# EAGLE design KeyJam (EAGLE 9.6.2)
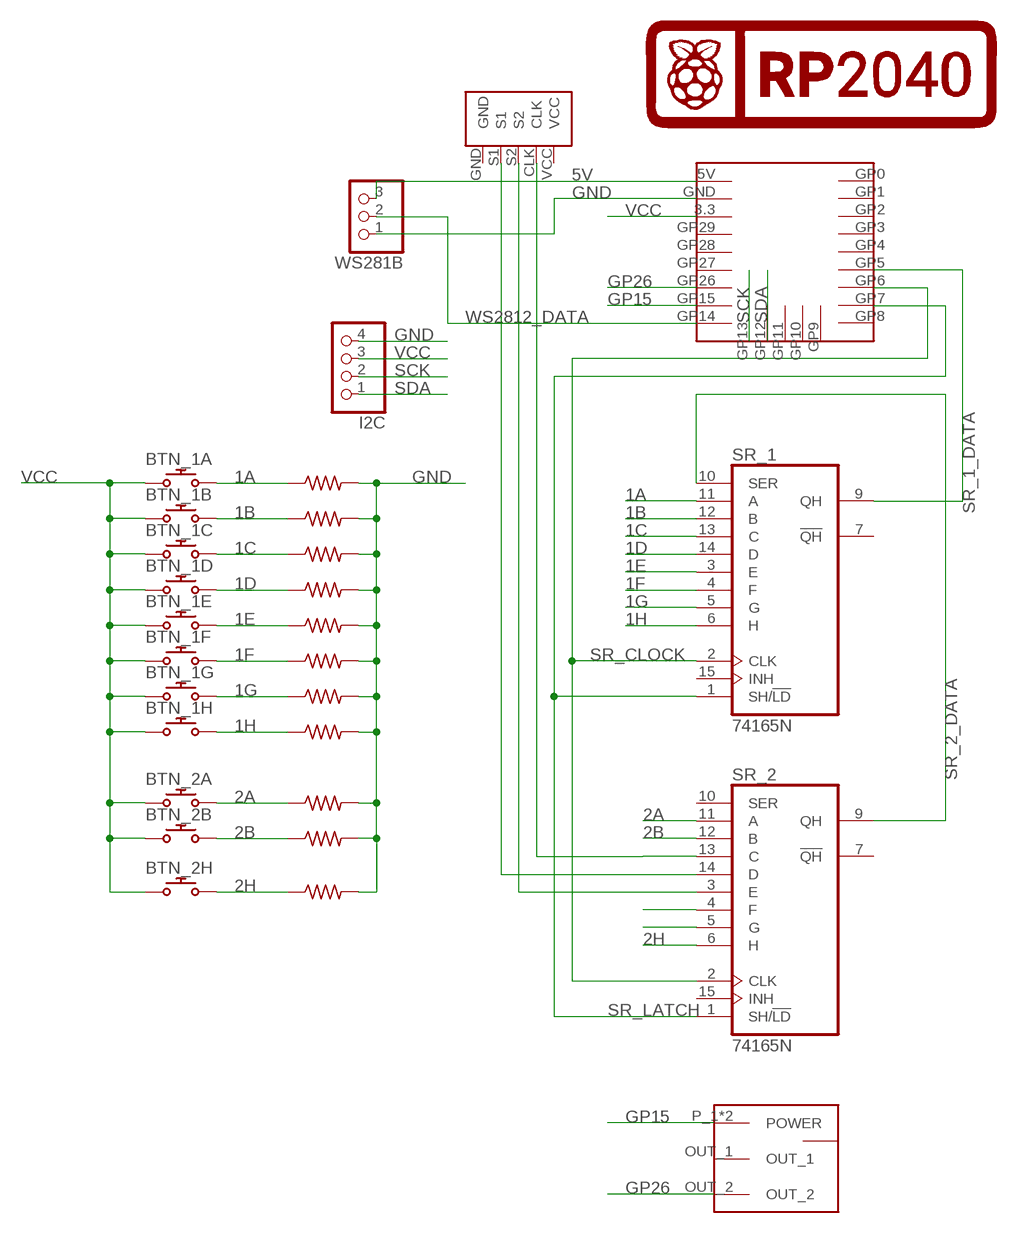
[diagram p0: schematic, sheet 1]

## Parts
BTN_1A  MX_SWITCH  [MX_SWITCH]
BTN_1B  MX_SWITCH  [MX_SWITCH]
BTN_1C  MX_SWITCH  [MX_SWITCH]
BTN_1D  MX_SWITCH  [MX_SWITCH]
BTN_1E  MX_SWITCH  [MX_SWITCH]
BTN_1F  MX_SWITCH  [MX_SWITCH]
BTN_1G  MX_SWITCH  [MX_SWITCH]
BTN_1H  MX_SWITCH  [MX_SWITCH]
BTN_2A  MX_SWITCH  [MX_SWITCH]
BTN_2B  MX_SWITCH  [MX_SWITCH]
BTN_2H  MX_SWITCH  [MX_SWITCH]
I2C  PINHD-1X4  [1X04]
R1  R-US_R1206  [R1206]
R2  R-US_R1206  [R1206]
R3  R-US_R1206  [R1206]
R4  R-US_R1206  [R1206]
R5  R-US_R1206  [R1206]
R6  R-US_R1206  [R1206]
R7  R-US_R1206  [R1206]
R8  R-US_R1206  [R1206]
R9  R-US_R1206  [R1206]
R10  R-US_R1206  [R1206]
R11  R-US_R1206  [R1206]
SLIDER  SLIDER  [SLIDER]
SR_1  74165N  [DIL16]
SR_2  74165N  [DIL16]
U$1  RP2040-ZERO  [RP2040-ZERO]
U$2  ROUND_ROTARY  [ROUND_ROTARY]
U$3  RASPI_RP2040_LOGO_20MM  [RASPI_RP2040_LOGO_20MM]
WS281B  PINHD-1X3  [1X03]

## Nets
1A: BTN_1A.$2 R1.1 SR_1.11(A)
1B: BTN_1B.$2 R2.1 SR_1.12(B)
1C: BTN_1C.$2 R3.1 SR_1.13(C)
1D: BTN_1D.$2 R4.1 SR_1.14(D)
1E: BTN_1E.$2 R5.1 SR_1.3(E)
1F: BTN_1F.$2 R6.1 SR_1.4(F)
1G: BTN_1G.$2 R7.1 SR_1.5(G)
1H: BTN_1H.$2 R8.1 SR_1.6(H)
2A: BTN_2A.$2 R9.1 SR_2.11(A)
2B: BTN_2B.$2 R10.1 SR_2.12(B)
2H: BTN_2H.$2 R11.1 SR_2.6(H)
5V: U$1.5V WS281B.3
GND: I2C.4 R1.2 R2.2 R3.2 R4.2 R5.2 R6.2 R7.2 R8.2 R9.2 R10.2 R11.2 U$1.GND WS281B.1
GP15: SLIDER.P_1(POWER) SLIDER.P_2(POWER) U$1.GP15
GP26: SLIDER.OUT_2 U$1.GP26
N$3: SR_2.13(C) U$2.CLK
N$4: SR_2.14(D) U$2.S1
N$5: SR_2.3(E) U$2.S2
N$6: SR_2.4(F)
N$7: SR_2.5(G)
SCK: I2C.2 U$1.GP13
SDA: I2C.1 U$1.GP12
SR_1_DATA: SR_1.9(QH) U$1.GP5
SR_2_DATA: SR_1.10(SER) SR_2.9(QH)
SR_CLOCK: SR_1.2(CLK) SR_2.2(CLK) U$1.GP6
SR_LATCH: SR_1.1(SH/!LD) SR_2.1(SH/!LD) U$1.GP7
VCC: BTN_1A.$1 BTN_1B.$1 BTN_1C.$1 BTN_1D.$1 BTN_1E.$1 BTN_1F.$1 BTN_1G.$1 BTN_1H.$1 BTN_2A.$1 BTN_2B.$1 BTN_2H.$1 I2C.3 U$1.3.3
WS2812_DATA: U$1.GP14 WS281B.2
Unconnected: SLIDER.OUT_1 SR_1.7(!QH) SR_1.15(INH) SR_2.7(!QH) SR_2.10(SER) SR_2.15(INH) U$1.GP0 U$1.GP1 U$1.GP2 U$1.GP3 U$1.GP4 U$1.GP8 U$1.GP9 U$1.GP10 U$1.GP11 U$1.GP27 U$1.GP28 U$1.GP29

## Power pins joined to a net without a drawn wire
GND: SLIDER.GND_1(GND) SLIDER.GND_2(GND) SR_1.8(GND) SR_2.8(GND) U$2.GND
VCC: SR_1.16(VCC) SR_2.16(VCC) U$2.VCC

## Library data of the parts
BTN_1A BTN_1B BTN_1C BTN_1D BTN_1E BTN_1F BTN_1G BTN_1H BTN_2A BTN_2B BTN_2H = KeyJam:MX_SWITCH: Cherry keymodule MX; FARNELL: 2292961; MOUSER: 540-MX1A-11NW
I2C = pinhead:PINHD-1X4: PIN HEADER
R1-R11 = adafruit:R-US_: RESISTOR, American symbol
SLIDER = KeyJam:SLIDER
SR_1 SR_2 = 74xx-us:74*165: 8-bit parallel load SHIFT REGISTER
U$1 = KeyJam:RP2040-ZERO
U$2 = KeyJam:ROUND_ROTARY
U$3 = SparkFun-Aesthetics:RASPI_RP2040_LOGO
WS281B = pinhead:PINHD-1X3: PIN HEADER

## Board
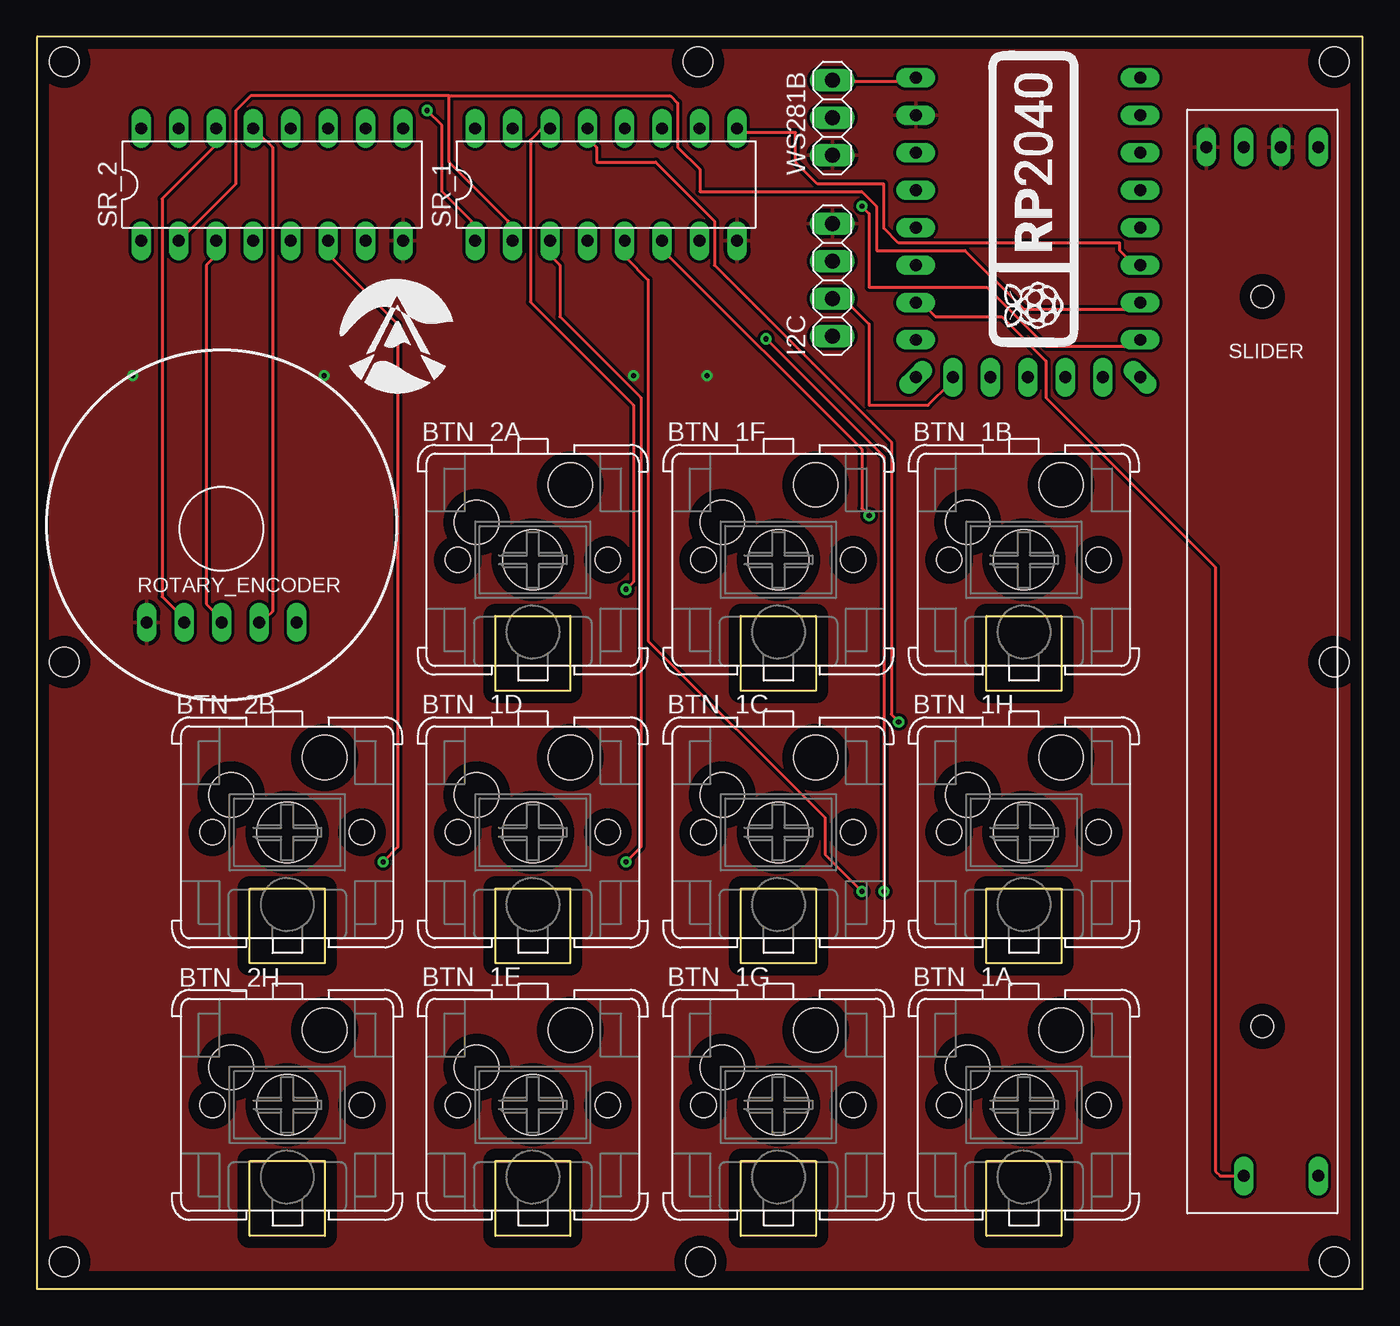
[diagram p1: board, top side]
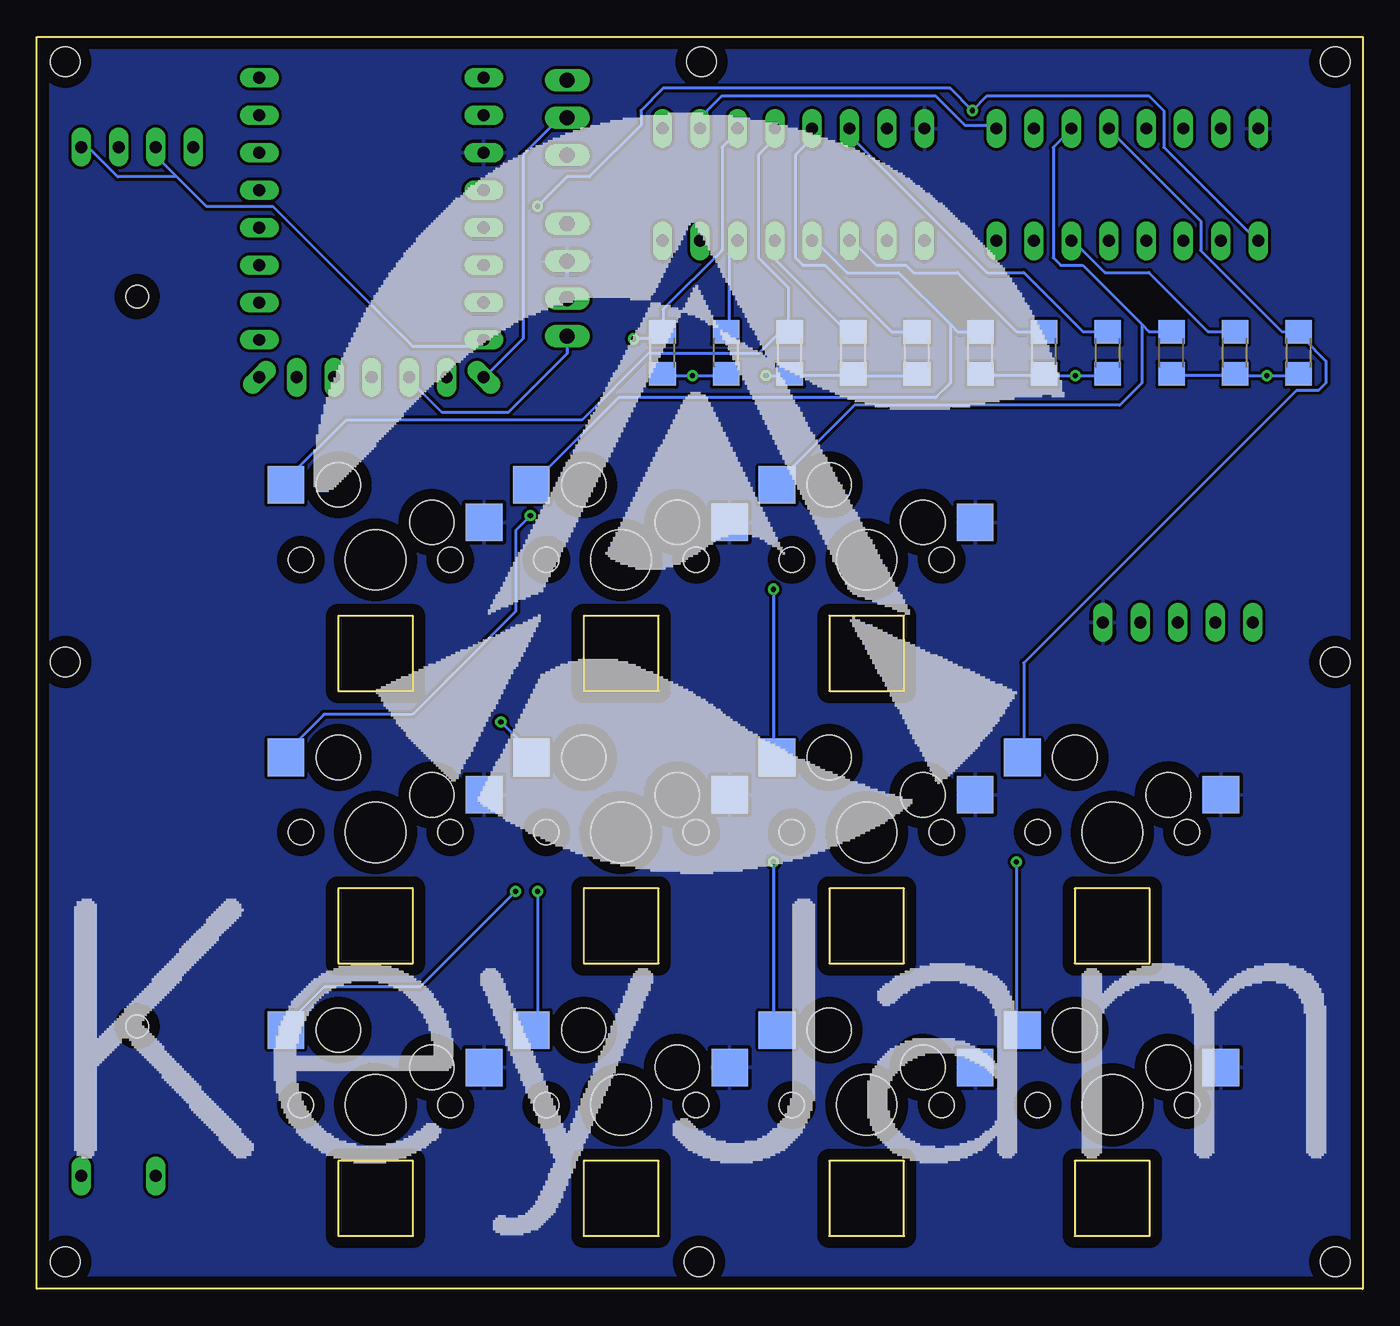
[diagram p2: board, bottom side, seen from below]

Size 90 x 85 mm. Coordinates in mm from the lower left corner, seen from the top.
Outline: 0,0 90,0 90,85 0,85 0,0
Copper layers (1*16): Top 0.035mm / dielectric 1.5mm / Bottom 0.035mm
Design rules "default *": minimum track width 8mil, minimum drill 0.35mm, track to track 8mil, track to pad 8mil, pad to pad 8mil, via to via 8mil, smd to smd 8mil, copper to edge 30mil, drill to drill 6mil, minimum pad ring 10mil, minimum via ring 8mil, stop-mask expansion 4mil, vias tented up to drill 0mil, thermal gap 10mil
Holes 2 mm at 1.85,83.3 1.85,1.85 88.07,1.85 88.07,83.3 1.85,42.57 88.07,42.57 45.04,1.85 44.88,83.3

### Footprints (pad centres in the part's own frame; a part is rotated, then mirrored left to right if it is on the bottom)
MX_SWITCH = smd 2.5 x 2.55 bottom: $1 -7.366,2.54; $2 6.096,5.08 | hole 1.7: -5.08,0; 5.08,0 | hole 4.1: 0,0 | hole 3: -3.81,2.54; 2.54,5.08
1X04 = drill 1.016 long: 1 -3.81,0; 2 -1.27,0; 3 1.27,0; 4 3.81,0
R1206 = smd 1.6 x 1.803: 1 -1.422,0; 2 1.422,0
SLIDER = drill 0.813 long: GND_1 1.27,36.83; GND_2 -3.81,36.83; OUT_1 3.81,-33.02; OUT_2 -1.27,-33.02; P_1 3.81,36.83; P_2 -1.27,36.83 | hole 1.524: 0,26.67; 0,-22.86
DIL16 = drill 0.813 long: 1 -8.89,-3.81; 2 -6.35,-3.81; 3 -3.81,-3.81; 4 -1.27,-3.81; 5 1.27,-3.81; 6 3.81,-3.81; 7 6.35,-3.81; 8 8.89,-3.81; 9 8.89,3.81; 10 6.35,3.81; 11 3.81,3.81; 12 1.27,3.81; 13 -1.27,3.81; 14 -3.81,3.81; 15 -6.35,3.81; 16 -8.89,3.81
RP2040-ZERO = drill 0.813 long: 3.3 -7.62,0; 5V -7.62,5.08; GND -7.62,2.54; GP0 7.62,5.08; GP1 7.62,2.54; GP2 7.62,0; GP3 7.62,-2.54; GP4 7.62,-5.08; GP5 7.62,-7.62; GP6 7.62,-10.16; GP7 7.62,-12.7; GP8 7.62,-15.24; GP9 5.08,-15.24; GP10 2.54,-15.24; GP11 0,-15.24; GP12 -2.54,-15.24; GP13 -5.08,-15.24; GP14 -7.62,-15.24; GP15 -7.62,-12.7; GP26 -7.62,-10.16; GP27 -7.62,-7.62; GP28 -7.62,-5.08; GP29 -7.62,-2.54
ROUND_ROTARY = drill 0.813 long: CLK 2.54,-6.35; GND -5.08,-6.35; S1 -2.54,-6.35; S2 0,-6.35; VCC 5.08,-6.35
1X03 = drill 1.016 long: 1 -2.54,0; 2 0,0; 3 2.54,0

### Placement (x,y rotation side)
BTN_1A  67,12.5 0 top
BTN_1B  67,49.5 0 top
BTN_1C  50.33,31 0 top
BTN_1D  33.67,31 0 top
BTN_1E  33.67,12.5 0 top
BTN_1F  50.33,49.5 0 top
BTN_1G  50.33,12.5 0 top
BTN_1H  67,31 0 top
BTN_2A  33.67,49.5 0 top
BTN_2B  17,31 0 top
BTN_2H  17,12.5 0 top
I2C  54,68.5 90 top
R1  47.53,63.54 270 bottom
R2  38.89,63.54 270 bottom
R3  30.26,63.54 270 bottom
R4  17.3,63.54 270 bottom
R5  21.62,63.54 270 bottom
R6  25.94,63.54 270 bottom
R7  34.58,63.54 270 bottom
R8  43.21,63.54 270 bottom
R9  12.99,63.54 270 bottom
R10  4.35,63.54 270 bottom
R11  8.67,63.54 270 bottom
SLIDER  83.19,40.69 0 top
SR_1  38.64,74.97 0 top
SR_2  15.97,74.97 0 top
U$1  67.28,77.13 0 top
U$2  12.54,51.6 0 top
U$3  67.66,73.95 90 top
WS281B  54,79.5 90 top

### Tracks (layer width: path | path; a pad name or v marks a point on that pad's centre or on a via)
1A  (via drill 0.35)
  Top 0.203: v57.5,27 57.5,56.5 v49.5,64.5
  Bottom 0.203: SR_1.11 42.5,78.5 43.5,77.5 43.5,70.5 47.5,66.5 47.5,65 R1.1 48,64.5 v49.5,64.5 | v57.5,27 64,20.5 70.5,20.5 73,18 BTN_1A.$2
1B
  Bottom 0.203: 39,65.5 39,68 41,70 41,77 39.5,78.5 SR_1.12 | 39,65.5 39,65 R2.1 39,65.5 | 39,65.5 41,63.5 48.5,63.5 53,59 69,59 73,55 BTN_1B.$2
1C  (via drill 0.35)
  Top 0.203: v58.5,38.5 58,39 58,57.5 46,69.5 46,72.5 42,76.5 38,76.5 38,77.5 37.5,78 37.5,78.5 SR_1.13
  Bottom 0.203: R3.1 30.5,65 32,65 36.5,69.5 38,69.5 38.5,70 38.5,77 37,78.5 SR_1.13 | v58.5,38.5 56.5,36.5 BTN_1C.$2
1D  (via drill 0.35)
  Top 0.203: v40,47.5 40.5,48 40.5,60 33.5,67 33.5,78 34.5,79 SR_1.14
  Bottom 0.203: R4.1 17.5,65 19,65 23,69 25.5,69 35,78.5 SR_1.14 | v40,47.5 40,36.5 BTN_1D.$2
1E  (via drill 0.35)
  Top 0.203: v40,29 41,30 41,60.5 35.5,66 35.5,69.5 35,70 35,71 SR_1.3
  Bottom 0.203: R5.1 22,65 23.5,65 27.5,69 30.5,69 31,69.5 33,69.5 34.5,71 SR_1.3 | v40,29 40,18 BTN_1E.$2
1F
  Bottom 0.203: 28,65.5 31.5,69 35,69 37,71 SR_1.4 | 28,65.5 27.5,65 26,65 R6.1 | 28,65.5 28,61.5 29,60.5 50.5,60.5 56,55 BTN_1F.$2
1G  (via drill 0.35)
  Top 0.203: v56,27 53.5,29.5 53.5,32 41.5,44 41.5,68.5 40,70 40,71 SR_1.5
  Bottom 0.203: R7.1 35,65 40,70 40,71 SR_1.5 | v56,27 56,18 BTN_1G.$2
1H  (via drill 0.35)
  Top 0.203: v56.5,52.5 56,53 56,57 42.5,70.5 42.5,71 SR_1.6
  Bottom 0.203: R8.1 43,65 43,70.5 42.5,71 SR_1.6 | v56.5,52.5 57.5,51.5 57.5,46 64.5,39 70.5,39 73,36.5 BTN_1H.$2
2A
  Bottom 0.203: 15,65.5 19,69.5 20.5,69.5 21,70 21,77.5 20,78.5 SR_2.11 | 15,65.5 14.5,65 13,65 R9.1 | 15,65.5 15,61.5 16.5,60 34.5,60 39.5,55 BTN_2A.$2
2B
  Bottom 0.203: SR_2.12 17,78.5 11,72.5 11,70.5 5.5,65 4.5,65 R10.1 4,64.5 2.5,63 2.5,61.5 3,61 4.5,61 23,42.5 23,36.5 BTN_2B.$2
2H  (via drill 0.35)
  Top 0.203: v23.5,29 24.5,30 24.5,65.5 20,70 20,71 SR_2.6
  Bottom 0.203: R11.1 9,65 10.5,65 14.5,69 17.5,69 19.5,71 SR_2.6 | v23.5,29 23.5,18 BTN_2H.$2
5V
  Top 0.203: U$1.5V 59.5,82 54,82 WS281B.3
GND  (via drill 0.35)
  Bottom 0.203: R4.2 17.5,62 v19.5,62 21.5,62 R5.2 22,62 25.5,62 R6.2 | R10.2 4.5,62 v6.5,62 8.5,62 R11.2 9,62 12.5,62 R9.2 | R8.2 43.5,62 v45.5,62 47.5,62 R1.2 | v40.5,62 39,62 R2.2 38.5,62 35,62 R7.2 34.5,62 30.5,62 R3.2
  pour Top: -0.54,85.86 -0.54,1.31 93.44,1.31 93.44,85.86
GP15
  Bottom 0.203: 80.5,75.5 81.5,76.5 81.5,77.5 SLIDER.P_2 | 80.5,75.5 78.5,73.5 74,73.5 64.5,64 60,64 U$1.GP15 | 80.5,75.5 84.5,75.5 86.5,77.5 SLIDER.P_1
GP26
  Top 0.203: U$1.GP26 60,67 61,66 65.5,66 68.5,63 68.5,60.5 80,49 80,8 80.33,7.67 SLIDER.OUT_2
N$3
  Top 0.203: U$2.CLK 15.5,45.5 16,46 16,77.5 15,78.5 SR_2.13
N$4
  Top 0.203: U$2.S1 10,45.5 8.5,47 8.5,74 12,77.5 12,78.5 SR_2.14
N$5
  Top 0.203: U$2.S2 12.5,45.5 11.5,46.5 11.5,69.5 12,70 12,71 SR_2.3
SCK
  Top 0.203: U$1.GP13 62,61.5 60.5,60 56.5,60 56.5,65.5 55,67 54,67 I2C.2
SDA
  Bottom 0.203: I2C.1 54,63.5 58,59.5 62.5,59.5 64.5,61.5 U$1.GP12
SR_1_DATA
  Top 0.203: SR_1.9 48,78.5 51.5,78.5 51.5,76.5 53,75 57.5,75 57.5,72 58.5,71 73.5,71 73.5,70.5 74.5,69.5 U$1.GP5
SR_2_DATA
  Bottom 0.203: SR_2.9 25,79 27,79 29,81 43.5,81 44.5,80 44.5,79 SR_1.10
SR_CLOCK
  Top 0.203: 28,81 14.5,81 13.5,80 13.5,75 10,71.5 SR_2.2 | 28,81 28,76.5 32,72.5 32,71.5 SR_1.2 | 28,81 43,81 43.5,80.5 43.5,77.5 45,76 45,74.5 56,74.5 57,73.5 57,70.5 63,70.5 67,66.5 74.5,66.5 U$1.GP6
SR_LATCH  (via drill 0.35)
  Top 0.203: v26.5,80 27.5,79 27.5,74.5 29.5,72.5 29.5,71.5 SR_1.1 | v56,73.5 56.5,73 56.5,68 64.5,68 68.5,64 74.5,64 U$1.GP7
  Bottom 0.203: SR_2.1 7.5,71.5 13.5,77.5 13.5,80 14.5,81 25.5,81 v26.5,80 28,81.5 47.5,81.5 49,80 49,79 52.5,75.5 54,75.5 v56,73.5
VCC
  pour Bottom: -1.81,86.59 -1.81,0.04 95.98,0.04 95.98,86.59
WS2812_DATA
  Bottom 0.203: WS281B.2 54.5,79.5 57,77 57,64.5 59.5,62 U$1.GP14

### Text on the board
tNames: SLIDER | ROTARY_ENCODER